# EAGLE design Cymbals (EAGLE 9.2.2)
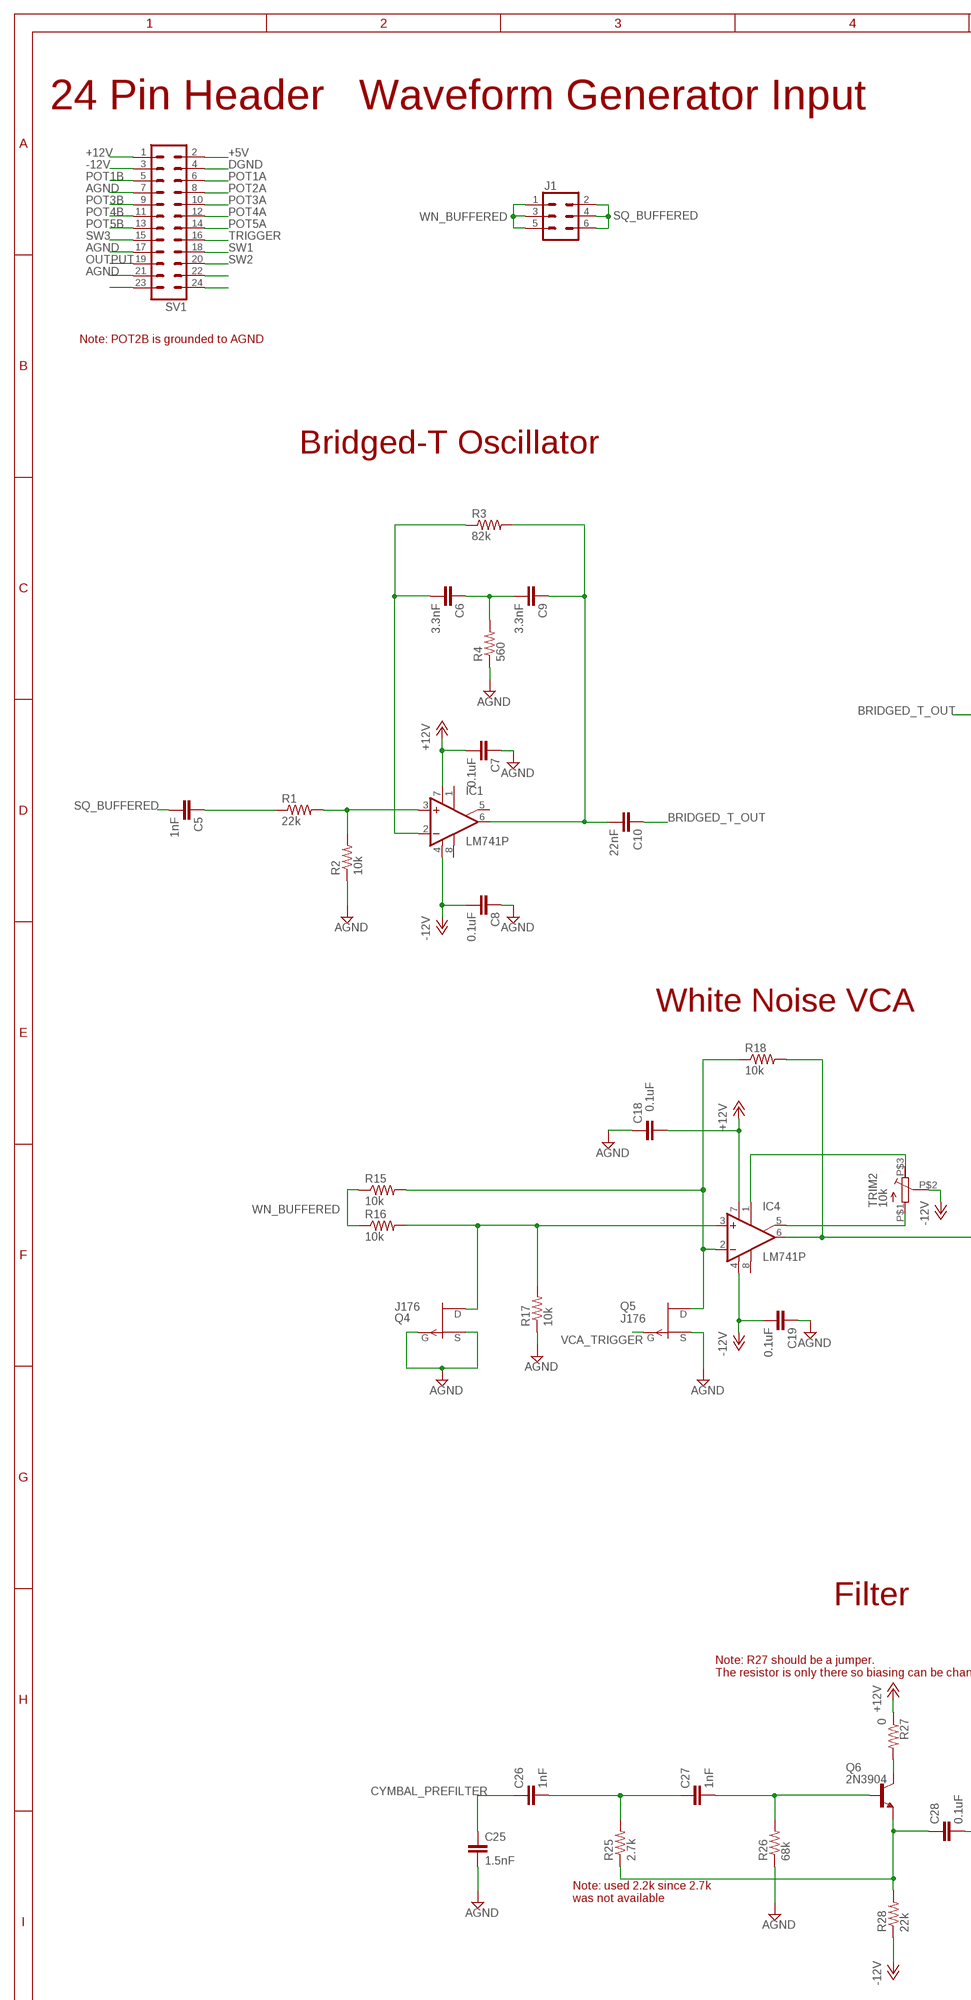
[diagram p0: schematic, sheet 1, part 1 of 2]
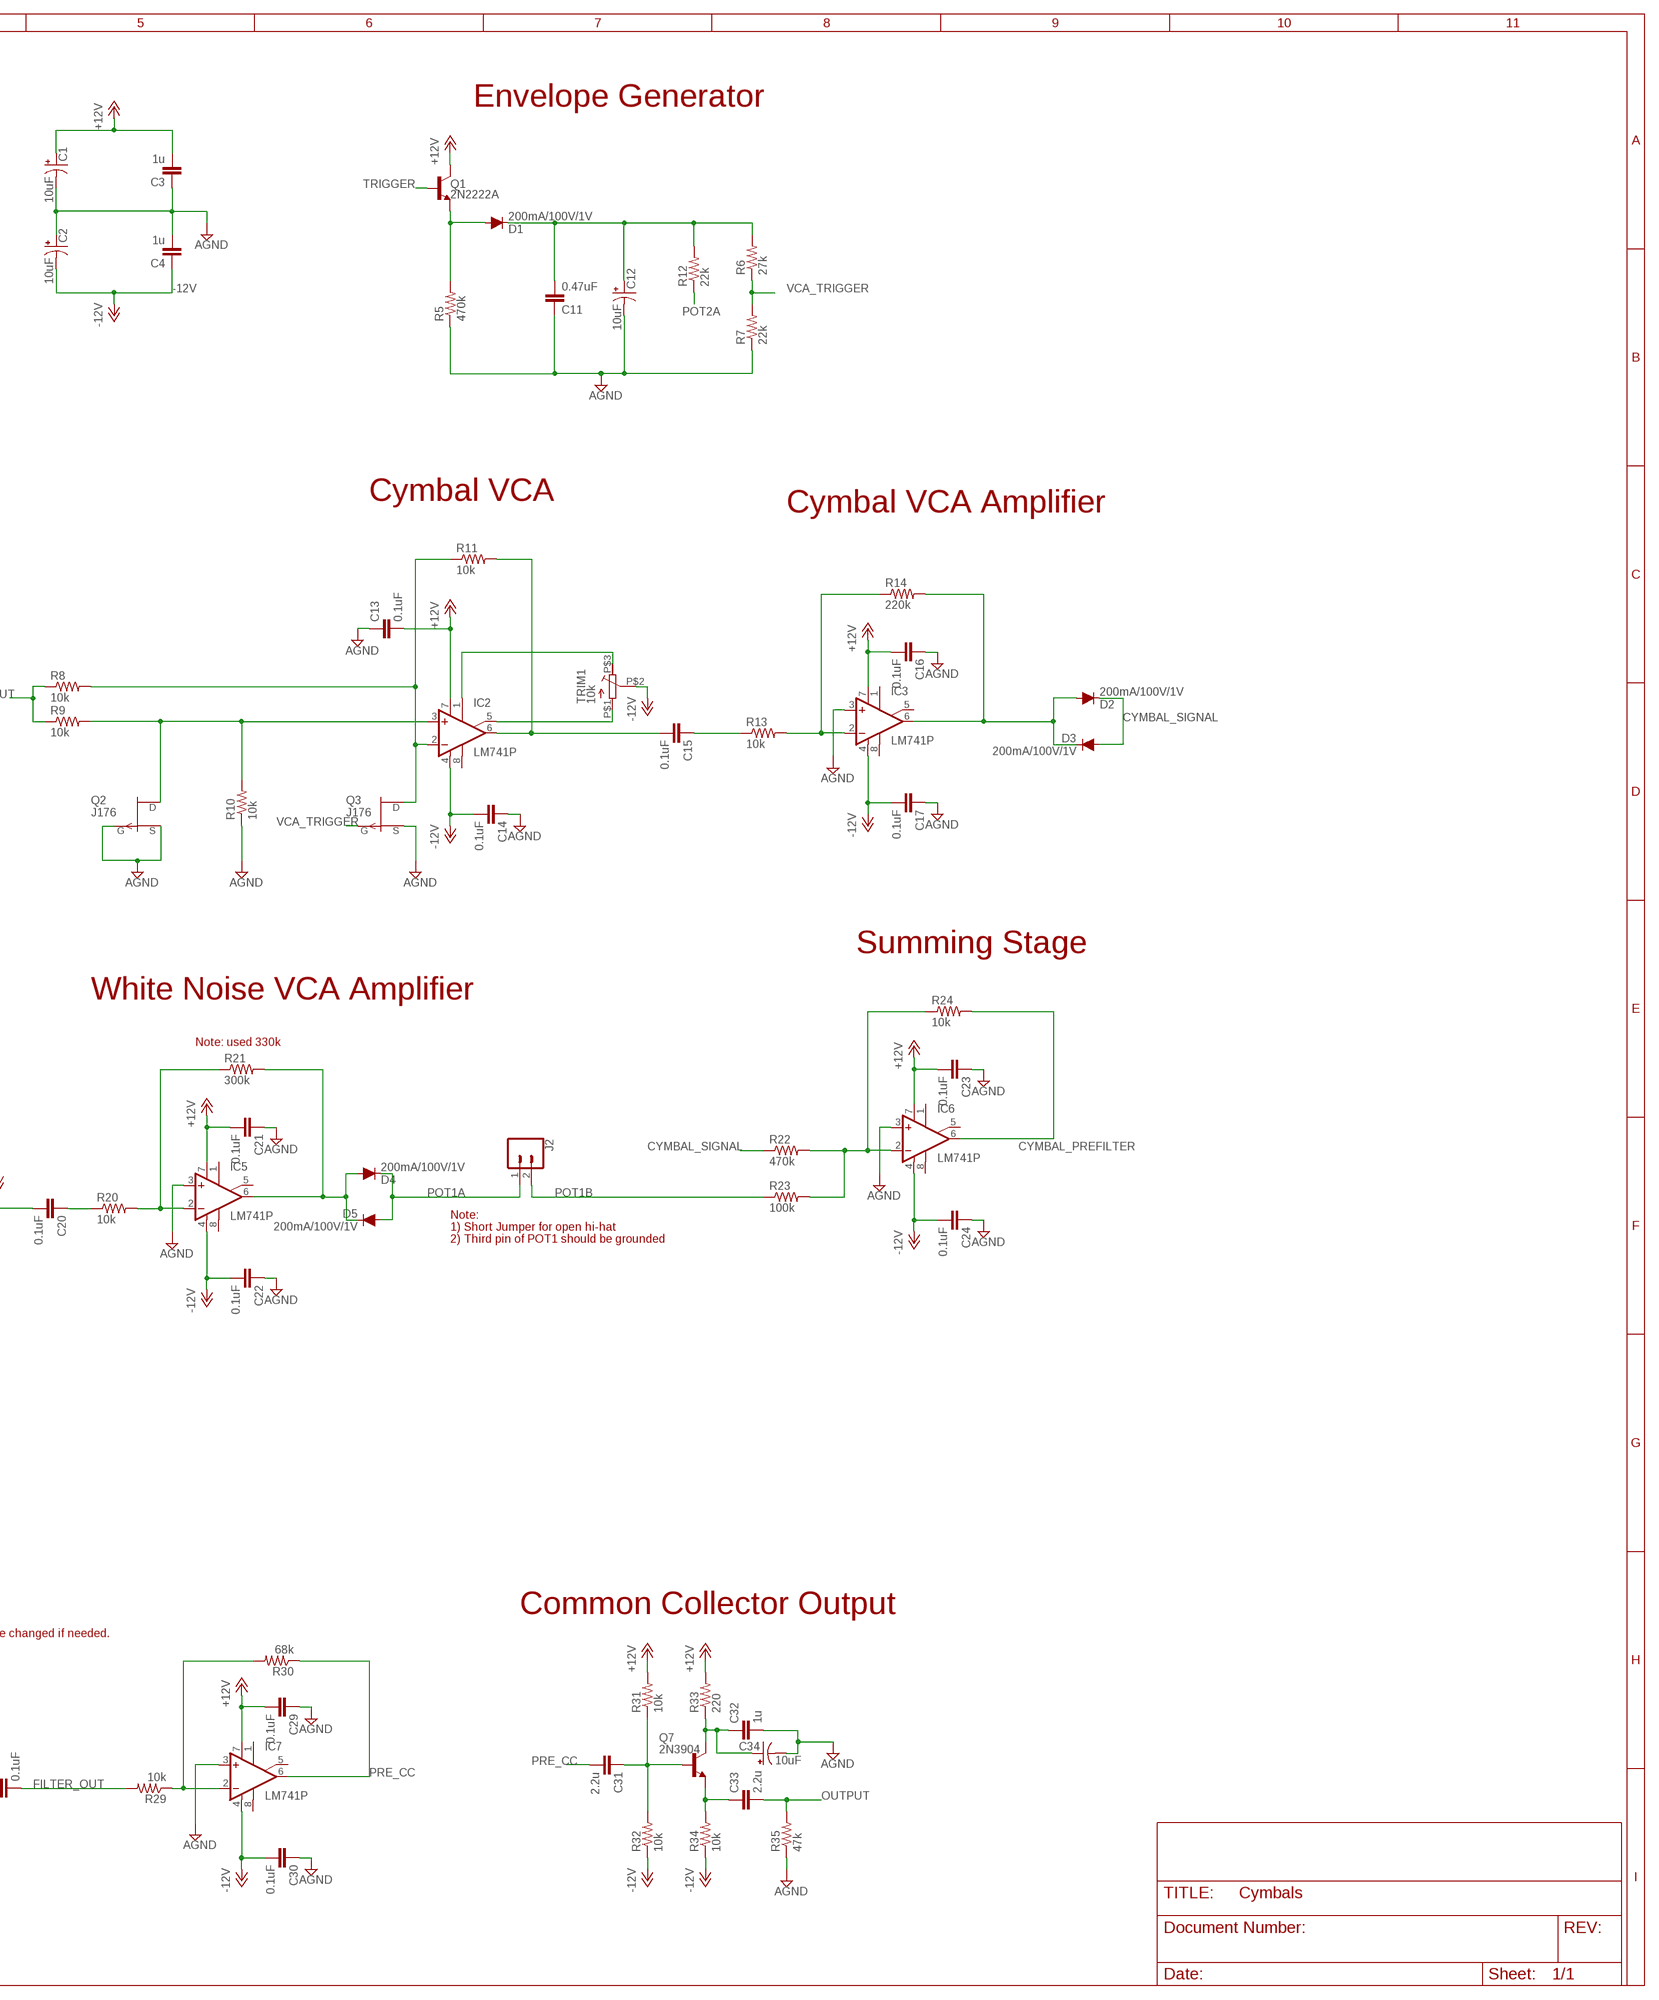
[diagram p1: schematic, sheet 1, part 2 of 2]

## Parts
C1  10uF  CPOL-USE2.5-6  [E2,5-6]
C2  10uF  CPOL-USE2.5-6  [E2,5-6]
C3  1u  C-EU050-024X044  [C050-024X044]
C4  1u  C-EU050-024X044  [C050-024X044]
C5  1nF  C-EU050-024X044  [C050-024X044]
C6  3.3nF  C-EU050-024X044  [C050-024X044]
C7  0.1uF  C-EU050-024X044  [C050-024X044]
C8  0.1uF  C-EU050-024X044  [C050-024X044]
C9  3.3nF  C-EU050-024X044  [C050-024X044]
C10  22nF  C-EU050-024X044  [C050-024X044]
C11  0.47uF  C-EU050-024X044  [C050-024X044]
C12  10uF  CPOL-USE2.5-6  [E2,5-6]
C13  0.1uF  C-EU050-024X044  [C050-024X044]
C14  0.1uF  C-EU050-024X044  [C050-024X044]
C15  0.1uF  C-EU050-024X044  [C050-024X044]
C16  0.1uF  C-EU050-024X044  [C050-024X044]
C17  0.1uF  C-EU050-024X044  [C050-024X044]
C18  0.1uF  C-EU050-024X044  [C050-024X044]
C19  0.1uF  C-EU050-024X044  [C050-024X044]
C20  0.1uF  C-EU050-024X044  [C050-024X044]
C21  0.1uF  C-EU050-024X044  [C050-024X044]
C22  0.1uF  C-EU050-024X044  [C050-024X044]
C23  0.1uF  C-EU050-024X044  [C050-024X044]
C24  0.1uF  C-EU050-024X044  [C050-024X044]
C25  1.5nF  C-EU050-024X044  [C050-024X044]
C26  1nF  C-EU050-024X044  [C050-024X044]
C27  1nF  C-EU050-024X044  [C050-024X044]
C28  0.1uF  C-EU050-024X044  [C050-024X044]
C29  0.1uF  C-EU050-024X044  [C050-024X044]
C30  0.1uF  C-EU050-024X044  [C050-024X044]
C31  2.2u  C-EU050-024X044  [C050-024X044]
C32  1u  C-EU050-024X044  [C050-024X044]
C33  2.2u  C-EU050-024X044  [C050-024X044]
C34  10uF  CPOL-USE2.5-6  [E2,5-6]
D1  200mA/100V/1V  DIODE-1N4148  [DIODE-1N4148]
D2  200mA/100V/1V  DIODE-1N4148  [DIODE-1N4148]
D3  200mA/100V/1V  DIODE-1N4148  [DIODE-1N4148]
D4  200mA/100V/1V  DIODE-1N4148  [DIODE-1N4148]
D5  200mA/100V/1V  DIODE-1N4148  [DIODE-1N4148]
IC1  LM741P  [DIL08]
IC2  LM741P  [DIL08]
IC3  LM741P  [DIL08]
IC4  LM741P  [DIL08]
IC5  LM741P  [DIL08]
IC6  LM741P  [DIL08]
IC7  LM741P  [DIL08]
J1  CONN_03X2NO_SILK  [2X3-NS]
J2  CONN_02  [1X02]
Q1  2N2222A  TRANS_NPN-P2N2222A  [TO-92]
Q2  J176  [TO-92]
Q3  J176  [TO-92]
Q4  J176  [TO-92]
Q5  J176  [TO-92]
Q6  2N3904  [TO92]
Q7  2N3904  [TO92]
R1  22k  R-US_0207/7  [0207/7]
R2  10k  R-US_0207/7  [0207/7]
R3  82k  R-US_0207/7  [0207/7]
R4  560  R-US_0207/7  [0207/7]
R5  470k  R-US_0207/7  [0207/7]
R6  27k  R-US_0207/7  [0207/7]
R7  22k  R-US_0207/7  [0207/7]
R8  10k  R-US_0207/7  [0207/7]
R9  10k  R-US_0207/7  [0207/7]
R10  10k  R-US_0207/7  [0207/7]
R11  10k  R-US_0207/7  [0207/7]
R12  22k  R-US_0207/7  [0207/7]
R13  10k  R-US_0207/7  [0207/7]
R14  220k  R-US_0207/7  [0207/7]
R15  10k  R-US_0207/7  [0207/7]
R16  10k  R-US_0207/7  [0207/7]
R17  10k  R-US_0207/7  [0207/7]
R18  10k  R-US_0207/7  [0207/7]
R20  10k  R-US_0207/7  [0207/7]
R21  300k  R-US_0207/7  [0207/7]
R22  470k  R-US_0207/7  [0207/7]
R23  100k  R-US_0207/7  [0207/7]
R24  10k  R-US_0207/7  [0207/7]
R25  2.7k  R-US_0207/7  [0207/7]
R26  68k  R-US_0207/7  [0207/7]
R27  0  R-US_0207/7  [0207/7]
R28  22k  R-US_0207/7  [0207/7]
R29  10k  R-US_0207/7  [0207/7]
R30  68k  R-US_0207/7  [0207/7]
R31  10k  R-US_0207/7  [0207/7]
R32  10k  R-US_0207/7  [0207/7]
R33  220  R-US_0207/7  [0207/7]
R34  10k  R-US_0207/7  [0207/7]
R35  47k  R-US_0207/7  [0207/7]
SV1  MA12-2  [MA12-2]
TRIM1  10k  10K_TRIMMER  [10K_TRIM]
TRIM2  10k  10K_TRIMMER  [10K_TRIM]

## Nets
+5V: SV1.2
+12V: C1.+ C3.2 C7.2 C13.2 C16.2 C18.2 C21.2 C23.2 C29.2 IC1.7(V+) IC2.7(V+) IC3.7(V+) IC4.7(V+) IC5.7(V+) IC6.7(V+) IC7.7(V+) Q1.1(C) R27.1 R31.2 R33.2 SV1.1
-12V: C2.- C4.1 C8.2 C14.2 C17.2 C19.2 C22.2 C24.2 C30.2 IC1.4(V-) IC2.4(V-) IC3.4(V-) IC4.4(V-) IC5.4(V-) IC6.4(V-) IC7.4(V-) R28.1 R32.1 R34.1 SV1.3 TRIM1.P$2(S) TRIM2.P$2(S)
AGND: C1.- C2.+ C3.1 C4.2 C7.1 C8.1 C11.1 C12.- C13.1 C14.1 C16.1 C17.1 C18.1 C19.1 C21.1 C22.1 C23.1 C24.1 C25.2 C29.1 C30.1 C32.2 C34.- IC3.3(+IN) IC5.3(+IN) IC6.3(+IN) IC7.3(+IN) Q2.2(G) Q2.3(S) Q3.3(S) Q4.2(G) Q4.3(S) Q5.3(S) R2.1 R4.1 R5.1 R7.1 R10.1 R17.1 R26.1 R35.1 SV1.7 SV1.17 SV1.21
BRIDGED_T_OUT: C10.1 R8.1 R9.1
CYMBAL_PREFILTER: C25.1 C26.1 IC6.6(OUT) R24.2
CYMBAL_SIGNAL: D2.C D3.A R22.1
DGND: SV1.4
FILTER_OUT: C28.2 R29.2
N$1: C15.2 IC2.6(OUT) R11.2
N$2: IC2.3(+IN) Q2.1(D) R9.2 R10.2
N$3: IC2.2(-IN) Q3.1(D) R8.2 R11.1
N$4: IC2.5(ON2) TRIM1.P$1(A)
N$5: Q6.1(C) R27.2
N$6: C11.2 C12.+ D1.C R6.2 R12.2
N$7: IC2.1(ON1) TRIM1.P$3(E)
N$8: IC3.2(-IN) R13.2 R14.1
N$10: IC6.2(-IN) R22.2 R23.2 R24.1
N$14: C6.2 IC1.2(-IN) R3.1
N$24: SV1.23
N$25: SV1.24
N$26: SV1.22
N$27: C15.1 R13.1
N$32: IC5.2(-IN) R20.2 R21.1
N$33: IC7.2(-IN) R29.1 R30.2
N$34: C20.1 R20.1
N$36: C20.2 IC4.6(OUT) R18.2
N$38: D4.A D5.C IC5.6(OUT) R21.2
N$39: D2.A D3.C IC3.6(OUT) R14.2
N$47: C6.1 C9.2 R4.2
N$60: C9.1 C10.2 IC1.6(OUT) R3.2
N$61: IC1.3(+IN) R1.2 R2.2
N$62: C5.1 R1.1
N$63: C31.1 Q7.2(B) R31.1 R32.2
N$64: D1.A Q1.3(E) R5.2
N$65: IC4.3(+IN) Q4.1(D) R16.2 R17.2
N$66: IC4.2(-IN) Q5.1(D) R15.2 R18.1
N$67: IC4.5(ON2) TRIM2.P$1(A)
N$68: IC4.1(ON1) TRIM2.P$3(E)
N$71: C33.1 Q7.3(E) R34.2
N$72: C32.1 C34.+ Q7.1(C) R33.1
N$73: C26.2 C27.1 R25.2
N$74: C27.2 Q6.2(B) R26.2
N$75: C28.1 Q6.3(E) R25.1 R28.2
OUTPUT: C33.2 R35.2 SV1.19
POT1A: D4.C D5.A J2.1 SV1.6
POT1B: J2.2 R23.1 SV1.5
POT2A: R12.1 SV1.8
POT3A: SV1.10
POT3B: SV1.9
POT4A: SV1.12
POT4B: SV1.11
POT5A: SV1.14
POT5B: SV1.13
PRE_CC: C31.2 IC7.6(OUT) R30.1
SQ_BUFFERED: C5.2 J1.2 J1.4 J1.6
SW1: SV1.18
SW2: SV1.20
SW3: SV1.15
TRIGGER: Q1.2(B) SV1.16
VCA_TRIGGER: Q3.2(G) Q5.2(G) R6.1 R7.2
WN_BUFFERED: J1.1 J1.3 J1.5 R15.1 R16.1
Unconnected: IC1.1(ON1) IC1.5(ON2) IC1.8(OPT) IC2.8(OPT) IC3.1(ON1) IC3.5(ON2) IC3.8(OPT) IC4.8(OPT) IC5.1(ON1) IC5.5(ON2) IC5.8(OPT) IC6.1(ON1) IC6.5(ON2) IC6.8(OPT) IC7.1(ON1) IC7.5(ON2) IC7.8(OPT)

## Notes on the sheet
- 24 Pin Header | Waveform Generator Input | Envelope Generator
- Note: POT2B is grounded to AGND
- Bridged-T Oscillator
- Cymbal VCA
- Cymbal VCA Amplifier
- Summing Stage
- White Noise VCA
- White Noise VCA Amplifier
- Note: used 330k
- Note: 
  1) Short Jumper for open hi-hat
  2) Third pin of POT1 should be grounded
- Filter
- Common Collector Output
- Note: R27 should be a jumper.
  The resistor is only there so biasing can be changed if needed.
- Note: used 2.2k since 2.7k 
  was not available

## Library data of the parts
C1 C2 C12 C34 = rcl:CPOL-US: POLARIZED CAPACITOR, American symbol; SPICEPREFIX: C
C3-C11 C13-C33 = resistor:C-EU: CAPACITOR, European symbol
D1-D5 = SparkFun-DiscreteSemi:DIODE: Diode These are standard reverse protection diodes and small signal diodes. SparkFun Products: SparkFun SparkPunk Sound Kit <https://www.sparkfun.com/products/11177> SparkFun ESP8266 Thing <https://www.sparkfun.com/products/13231>; PROD_ID: DIO-08378
IC1-IC7 = linear:*741: OP AMP
J1 = SparkFun-Connectors:CONN_03X2: Multi connection point. Often used as Generic Header-pin footprint for 0.1 inch spaced/style header connections You can populate with any combo of single row headers, but if you'd like an exact match, check these: Header - 2x3 (Male, 0.1") <https://www.sparkfun.com/products/12807> (PRT-12807) Header - 2x3 (Female, 0.1") <https://www.sparkfun.com/products/13010> (PRT-13010) 2x3 Pin Shrouded Header <https://www.sparkfun.com/products/10877> (PRT-10877) On any of the 0.1 inch spaced packages, you can populate with these: Break Away Headers - Straight <https://www.sparkfun.com/products/116> (PRT-00116) Break Away Male Headers - Right Angle <https://www.sparkfun.com/products/553> (PRT-00553) Female Headers <https://www.sparkfun.com/products/115> (PRT-00115) Break Away Headers - Machine Pin <https://www.sparkfun.com/products/117> (PRT-00117) Break Away Female Headers - Swiss Machine Pin <https://www.sparkfun.com/products/743> (PRT-00743) Special note: the shrouded connector mates well with our 3x2 ribbon cables: Ribbon Crimp Connector - 6-pin (2x3, Female) <https://www.sparkfun.com/products/10651> (PRT-10651) Ribbon Cable - 6 wire (15ft) <https://www.sparkfun.com/products/10646> (PRT-10646)
J2 = SparkFun-Connectors:CONN_02: Multi connection point. Often used as Generic Header-pin footprint for 0.1 inch spaced/style header connections On any of the 0.1 inch spaced packages, you can populate with these: Break Away Headers - Straight <https://www.sparkfun.com/products/116> (PRT-00116) Break Away Male Headers - Right Angle <https://www.sparkfun.com/products/553> (PRT-00553) Female Headers <https://www.sparkfun.com/products/115> (PRT-00115) Break Away Headers - Machine Pin <https://www.sparkfun.com/products/117> (PRT-00117) Break Away Female Headers - Swiss Machine Pin <https://www.sparkfun.com/products/743> (PRT-00743) For SCREWTERMINALS and SPRING TERMINALS visit here: Screw Terimnals on SparkFun.com <https://www.sparkfun.com/search/results?term=Screw+Terminals> (5mm/3.5mm/2.54mm spacing) This device is also useful as a general connection point to wire up your design to another part of your project. Our various solder wires solder well into these plated through hole pads. Hook-Up Wire - Assortment (Stranded, 22 AWG) <https://www.sparkfun.com/products/11375> (PRT-11375) Hook-Up Wire - Assortment (Solid Core, 22 AWG) <https://www.sparkfun.com/products/11367> (PRT-11367) View the entire wire category on our website here <https://www.sparkfun.com/categories/141> Special notes: Molex polarized connector foot print use with: PRT-08233 with associated crimp pins and housings. 2.54_SCREWTERM for use with PRT-10571. 3.5mm Screw Terminal footprints for PRT-08084 5mm Screw Terminal footprints for use with PRT-08432
Q1 = SparkFun-DiscreteSemi:TRANS_NPN: NPN transistor Current controlled devices typically used to amplify current or used as a switch. BC547 - COM-08928 <http://www.sparkfun.com/products/8928> (TO-92 45V 100mA) (1.Collector 2.Base 3.Emitter) 2N3904 - COM-00521 <http://www.sparkfun.com/products/521> (TO-92 40V 200mA) (1.Emitter 2.Base 3.Collector) P2N2222A - COM-12852 <http://www.sparkfun.com/products/12852> (TO-92 40V 600mA) (1.Collector 2.Base 3.Emitter); PROD_ID: TRANS-09536; VALUE: 600mA/40V
Q2-Q5 = Capstone:J176
Q6 Q7 = transistor:2N3904: NPN TRANSISTOR
R1-R18 R20-R35 = rcl:R-US_: RESISTOR, American symbol; SPICEPREFIX: R
SV1 = con-lstb:MA12-2: PIN HEADER; OC_FARNELL: unknown; OC_NEWARK: unknown
TRIM1 TRIM2 = Capstone:10K_TRIMMER

## Board
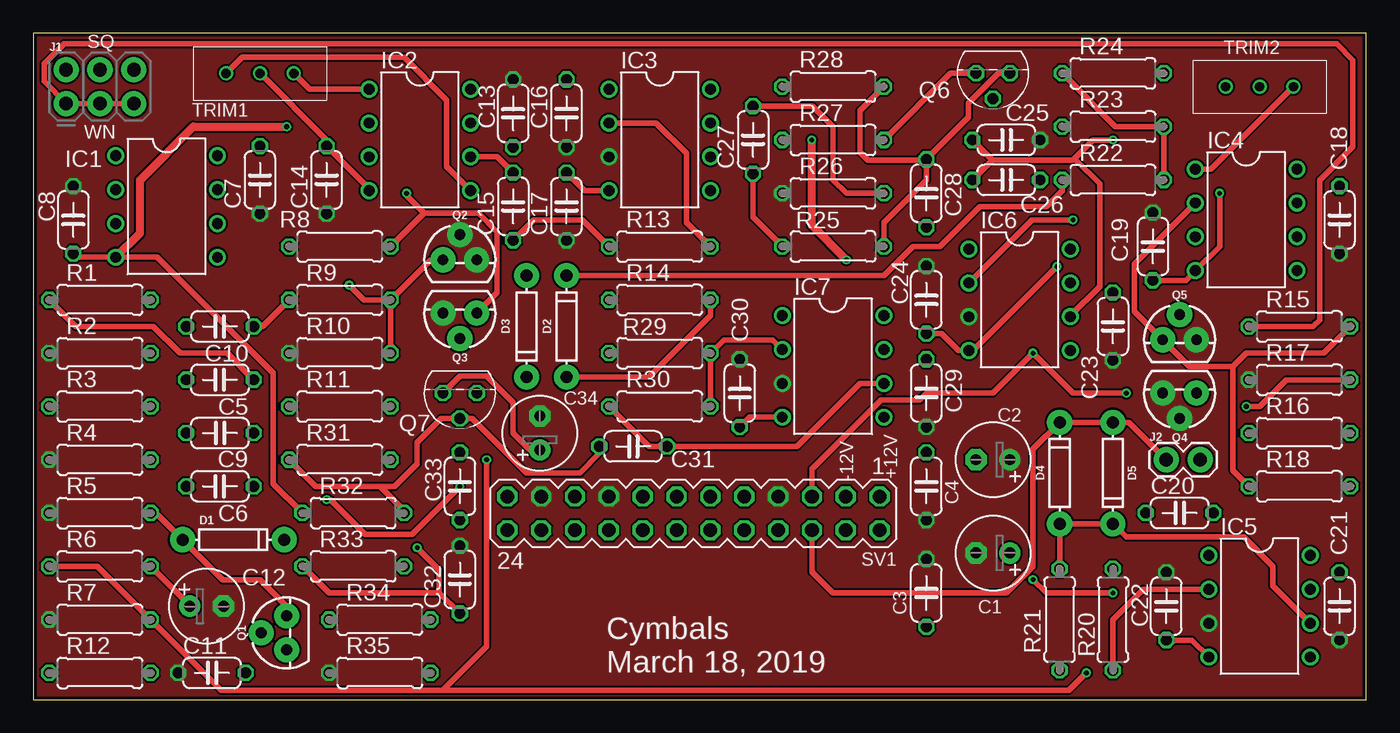
[diagram p2: board, top side]
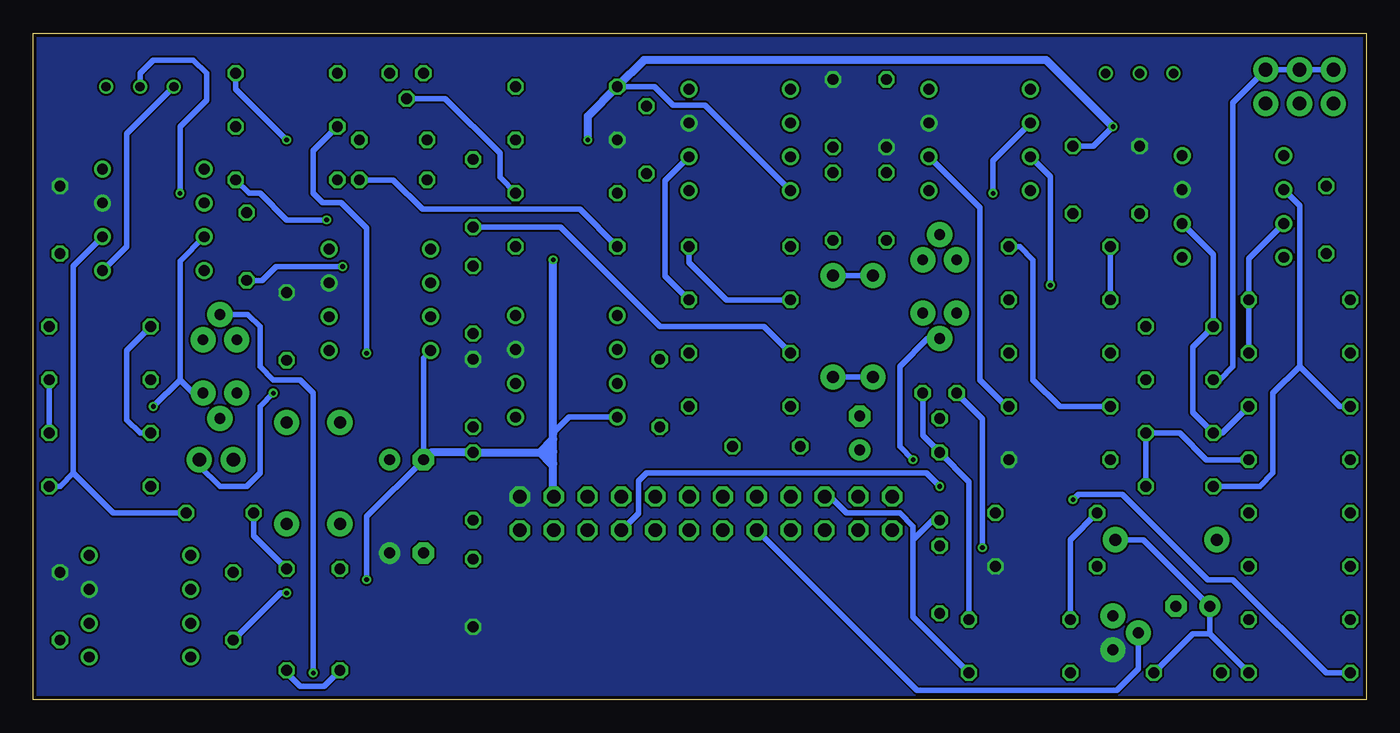
[diagram p3: board, bottom side, seen from below]

Size 100 x 50 mm. Coordinates in mm from the lower left corner, seen from the top.
Outline: 0,0 100,0 100,50 0,50 0,0
Copper layers (1*16): Top 0.035mm / dielectric 1.5mm / Bottom 0.035mm
Design rules "JLCPCB2Layer": minimum track width 6mil, minimum drill 10mil, track to track 6mil, track to pad 6mil, pad to pad 6mil, via to via 6mil, smd to smd 0mil, copper to edge 10mil, drill to drill 10mil, minimum pad ring 6mil, minimum via ring 6mil, stop-mask expansion 2mil, vias tented up to drill 100mil, thermal gap 10mil

### Footprints (pad centres in the part's own frame; a part is rotated, then mirrored left to right if it is on the bottom)
E2,5-6 = drill 0.813 pad 1.6: + -1.27,0 | drill 0.813 pad 1.6 octagon: - 1.27,0
C050-024X044 = drill 0.813 octagon: 1 -2.54,0; 2 2.54,0
DIODE-1N4148 = drill 0.9 pad 1.88: A -3.81,0; C 3.81,0
DIL08 = drill 0.813 pad 1.27: 1 -3.81,-3.81; 2 -1.27,-3.81; 3 1.27,-3.81; 4 3.81,-3.81; 5 3.81,3.81; 6 1.27,3.81; 7 -1.27,3.81; 8 -3.81,3.81
2X3-NS = drill 1.016 pad 1.88: 1 -2.54,-1.27; 2 -2.54,1.27; 3 0,-1.27; 4 0,1.27; 5 2.54,-1.27; 6 2.54,1.27
1X02 = drill 1.016 pad 1.88: 1 0,0; 2 2.54,0
TO-92 = drill 0.813 pad 1.88: 1 -1.27,0; 2 0,1.905; 3 1.27,0
TO92 = drill 0.813 octagon: 1 1.27,0; 2 0,1.905; 3 -1.27,0
0207/7 = drill 0.813 octagon: 1 -3.81,0; 2 3.81,0
MA12-2 = drill 1.016 octagon: 1 -13.97,-1.27; 2 -13.97,1.27; 3 -11.43,-1.27; 4 -11.43,1.27; 5 -8.89,-1.27; 6 -8.89,1.27; 7 -6.35,-1.27; 8 -6.35,1.27; 9 -3.81,-1.27; 10 -3.81,1.27; 11 -1.27,-1.27; 12 -1.27,1.27; 13 1.27,-1.27; 14 1.27,1.27; 15 3.81,-1.27; 16 3.81,1.27; 17 6.35,-1.27; 18 6.35,1.27; 19 8.89,-1.27; 20 8.89,1.27; 21 11.43,-1.27; 22 11.43,1.27; 23 13.97,-1.27; 24 13.97,1.27
10K_TRIM = drill 0.7: P$1 2.46,2; P$2 5,2; P$3 7.54,2

### Placement (x,y rotation side)
C1  72,11 180 top
C2  72,18 180 top
C3  67,8 270 top
C4  67,16 270 top
C5  14,24 180 top
C6  14,16 180 top
C7  17,39 90 top
C8  3,36 270 top
C9  14,20 0 top
C10  14,28 180 top
C11  13.4,2 0 top
C12  13,7 0 top
C13  36,44 270 top
C14  22,39 90 top
C15  36,37 90 top
C16  40,44 90 top
C17  40,37 90 top
C18  98,36 90 top
C19  84,34 270 top
C20  86,14 0 top
C21  98,7 90 top
C22  85,7 270 top
C23  81,28 90 top
C24  67,30 270 top
C25  73,42 0 top
C26  73,39 0 top
C27  54,42 90 top
C28  67,38 270 top
C29  67,23 90 top
C30  53,23 270 top
C31  45,19 0 top
C32  32,9 90 top
C33  32,16 270 top
C34  38,20 90 top
D1  15,12 0 top
D2  40,28 90 top
D3  37,28 270 top
D4  77,17 90 top
D5  81,17 270 top
IC1  10,37 270 top
IC2  29,42 270 top
IC3  47,42 270 top
IC4  91,36 270 top
IC5  92,7 270 top
IC6  74,30 270 top
IC7  60,25 270 top
J1  5,46 0 top
J2  85,18 0 top
Q1  19,5 90 top
Q2  32,33 0 top
Q3  32,29 180 top
Q4  86,23 180 top
Q5  86,27 0 top
Q6  72,47 180 top
Q7  32,23 180 top
R1  5,30 0 top
R2  5,26 0 top
R3  5,22 0 top
R4  5,18 0 top
R5  5,14 0 top
R6  5,10 0 top
R7  5,6 0 top
R8  23,34 0 top
R9  23,30 0 top
R10  23,26 0 top
R11  23,22 0 top
R12  5,2 0 top
R13  47,34 0 top
R14  47,30 0 top
R15  95,28 0 top
R16  95,20 0 top
R17  95,24 0 top
R18  95,16 0 top
R20  81,6 270 top
R21  77,6 90 top
R22  81,39 0 top
R23  81,43 0 top
R24  81,47 0 top
R25  60,34 180 top
R26  60,38 0 top
R27  60,42 0 top
R28  60,46 0 top
R29  47,26 180 top
R30  47,22 0 top
R31  23,18 0 top
R32  24,14 0 top
R33  24,10 0 top
R34  26,6 0 top
R35  26,2 0 top
SV1  49.53,13.97 180 top
TRIM1  12,45 0 top
TRIM2  87,44 0 top

### Tracks (layer width: path | path; a pad name or v marks a point on that pad's centre or on a via)
+12V
  pour Bottom (no thermals): -2,52 102,52 102,-2 -2,-2
-12V  (via drill 0.35)
  Top 0.406: C22.2 86.92,4.46 IC5.4 | C19.2 86.46,31.46 IC4.4 89,34 v89,38 | TRIM1.P$2 22,42 C14.2 25.19,38.35 IC2.4 | C17.2 41.35,38.19 IC3.4 | C24.2 68.14,27.46 69.41,26.19 IC6.4 70.49,26.19 v76.8,32.5 | C30.2 53.73,21.19 IC7.4 | R32.1 18,16.19 18,24.5 9.31,33.19 IC1.4 3.27,33.19 C8.2 | v75,9 76,8 v81,8
  Top 0.61: v61,33 58.4,35.6 v58.4,42 | IC1.4 8,35 8,39 12,43 v19,43
  Bottom 0.406: v89,38 89,43 87,45 87,47 88,48 91,48 92,47 TRIM2.P$2 | R34.1 22.19,12 R32.1 | v19,43 20.46,41.54 C14.2 | IC3.4 49.6,44.6 52,44.6 53.4,46 R28.1 | IC7.4 59.81,21.19 61,20 | IC6.4 70.73,25.65 C2.- 75,13.73 v75,9 | v76.8,32.5 81.8,32.5 82.84,31.46 C19.2 | v81,8 81.46,8 C22.2
  Bottom 0.61: SV1.3 61,15.28 61,17.7 | 61,17.7 61,18.6 | 61,18.6 61,19.54 | 61,19.54 61,20 v61,33 | v58.4,42 58.4,43.79 R28.1 54.19,48 24,48 v19,43 | C2.- 70.19,18.54 C4.1 62,18.54 | 61,18.6 61.06,18.54 62,18.54 | 62,18.54 61,19.54 | 62,18.54 61.16,17.7 61,17.7
AGND
  pour Top (no thermals): -1,51 -1,-1 101,-1 101,51
BRIDGED_T_OUT
  Top 0.406: R9.1 17.19,28 C10.1
  Bottom 0.406: R8.1 R9.1
CYMBAL_PREFILTER  (via drill 0.35)
  Top 0.406: C26.1 71.96,40.5 | 71.96,40.5 78,40.5 | 78,40.5 78.2,40.5 80,38.7 80,31 77.81,28.81 IC6.6 | 78,40.5 79.5,42 v81,42 | C25.1 71.96,40.5
  Bottom 0.406: v81,42 84.81,45.81 R24.2
CYMBAL_SIGNAL
  Top 0.406: D2.C 63.81,31.81 66,34 68,34 71,37 76,37 77.19,38.19 R22.1
  Bottom 0.406: D3.A D2.C
FILTER_OUT
  Bottom 0.406: R29.2 45.19,28 53,28 60.46,35.46 C28.2
N$1
  Top 0.406: IC2.6 34.81,40.73 C15.2
  Bottom 0.406: IC2.6 29,36.92 29,24 27,22 R11.2
N$2  (via drill 0.35)
  Top 0.406: R9.2 29.81,33 Q2.1 | v23.7,31.1 24.8,30 R9.2 | R9.2 R10.2
  Bottom 0.406: IC2.3 23.7,39.24 v23.7,31.1
N$3  (via drill 0.35)
  Top 0.406: R8.2 29.31,36.5 | Q3.1 34.8,30.53 34.8,35.1 33.4,36.5 29.31,36.5 | 29.31,36.5 28,37.81 v28,38
  Bottom 0.406: R8.2 26,34 25,33 25,24 23,22 R11.1 | v28,38 28,40.46 IC2.2
N$4
  Top 0.406: TRIM1.P$1 15.66,48.2 27.8,48.2 31,45 31,40 IC2.5
N$5
  Top 0.406: R27.2 68.81,47 Q6.1
N$6
  Top 0.406: R6.2 11.73,7.08 C12.+
  Bottom 0.406: R12.2 11.73,4.92 | 11.73,4.92 C12.+ 16.73,12 D1.C | 11.73,4.92 13.02,4.92 C11.2
N$7
  Top 0.406: TRIM1.P$3 20.73,45.81 IC2.1
N$8
  Top 0.406: IC3.2 46.73,43.27 49,41 49,35.81 R13.2
  Bottom 0.406: R13.2 50.81,32.81 48,30 R14.1
N$10  (via drill 0.35)
  Top 0.406: R24.1 81.19,43 R23.2 R22.2 | IC6.2 74.92,36 v78,36
  Bottom 0.406: v78,36 81,36 83,38 83.81,38 R22.2
N$14
  Bottom 0.406: IC1.2 5,37.08 5,25 | 5,25 2,22 R3.1 | 5,25 7,23 7,17 8,16 C6.2
N$27
  Top 0.406: C15.1 37.54,36 41.19,36 R13.1
N$32
  Top 0.406: R20.2 81,6 83.27,8.27 IC5.2
  Bottom 0.406: R21.1 78.19,1 80,1 81,2 R20.2
N$33
  Top 0.406: R30.2 R29.1 51.81,27 55.46,27 IC7.2
N$34
  Bottom 0.406: C20.1 83.46,12.27 R20.1
N$36
  Bottom 0.406: IC4.6 97,32.54 97,17 | 97,17 98,16 R18.2 | 97,17 94,14 C20.2
N$38
  Top 0.406: IC5.6 93,8.54 93,10 90.8,12.2 81.99,12.2 D5.C D4.A R21.2
N$39
  Top 0.406: D2.A 46.19,24.19 50.81,28.81 R14.2
  Bottom 0.406: D2.A D3.C | IC3.6 52.6,38.94 52.6,31.79 R14.2
N$47
  Bottom 0.406: C6.1 C9.2 14,20 12,18 R4.2
N$60
  Bottom 0.406: IC1.6 11.46,33.38 C10.2 13,26.46 13,21.54 C9.1 10.81,20 R3.2
N$61
  Bottom 0.406: R2.2 R1.2 8.81,33.11 IC1.3
N$62
  Top 0.406: R1.1 3.19,28 9,28 11,26 14.54,26 C5.1
N$63
  Top 0.406: R31.1 21.19,16 26,16 | 26,16 27.81,14.19 R32.2 | 26,16 27.1,16 28.8,17.7 28.8,19.3 30.6,21.1 30.61,21.09 Q7.2 32.91,21.09 37,17 41,17 42.46,18.46 C31.1
N$64
  Top 0.406: Q1.3 19,7 17,9 14.19,9 D1.A 9.19,14 R5.2
N$65  (via drill 0.35)
  Top 0.406: R17.2 94,24 92,22 v91,22
  Bottom 0.406: IC4.3 89,32.92 89,24 | 89,24 88,23 Q4.1 | R17.2 R16.2 | v91,22 89,24
N$66
  Top 0.406: IC4.2 82.6,32.68 82.6,29.13 Q5.1 86.73,25 90,25 | 90,25 91,26 96.81,26 R15.2 | 90,25 90,17.19 R18.1
N$67
  Bottom 0.406: TRIM2.P$1 93,42.46 93,34 IC4.5
N$68
  Top 0.406: TRIM2.P$3 88.35,39.81 IC4.1
N$71
  Bottom 0.406: R34.2 29.81,16.35 C33.1 33.27,19.81 Q7.3
N$72  (via drill 0.35)
  Top 0.406: R33.1 22.19,8 30.46,8 | 30.46,8 C32.1 | Q7.1 32.03,24.3 34,24.3 36,22.3 36,20 37.27,18.73 C34.+ | v28.8,11.4 30.46,9.74 30.46,8
  Bottom 0.406: Q7.1 28.8,21.07 v28.8,11.4
N$73
  Top 0.406: C27.1 54,36.19 R25.2
  Bottom 0.406: R25.2 58.99,36.8 70.8,36.8 73,39 C26.2
N$74
  Top 0.406: C27.2 58.46,44.54 60,43 60,39 61,38 R26.2
  Bottom 0.406: R26.2 65,39.19 65,41 69.09,45.09 Q6.2
N$75
  Top 0.406: R28.2 62,44.19 62,41.1 62.6,40.5 66.96,40.5 | 66.96,40.5 C28.1 70.16,43.7 70.16,44.76 72.4,47 Q6.3 | R25.1 63.81,35.81 67,39 67,40.46 66.96,40.5
OUTPUT
  Bottom 0.406: R35.2 34,6.19 34,12 | 34,12 32.54,13.46 C33.2 | 34,12 34,13 35,14 39,14 40.24,15.24 SV1.19
POT1A
  Top 0.406: J2.1 82.19,20.81 D5.A D4.C 75,18.81 75,10 73,8 60,8 58.42,9.58 SV1.6
POT1B  (via drill 0.35)
  Top 0.406: v82,23 78,23 v75,26 72,23 67,23 66.5,22.5 63.6,22.5 58.42,17.32 SV1.5
  Bottom 0.406: R23.1 79,41.19 79,38 78.3,37.3 76.9,37.3 75,35.4 v75,26 | v82,23 83,22 83,17 84,16 86,16 87.54,17.54 J2.2
POT2A  (via drill 0.35)
  Top 0.406: v32,16 28.4,12.4 24.9,12.4 22.3,15 v22,15
  Bottom 0.406: v32,16 33,17 54,17 54.6,16.4 54.6,13.98 SV1.8 | v22,15 21.6,15.4 18.3,15.4 11.9,9 10,9 3,2 R12.1
PRE_CC
  Top 0.406: IC7.6 62.03,23.73 57.3,19 C31.2 46.19,19 R30.1
SQ_BUFFERED
  Bottom 0.406: C5.2 11,24 10,25 10,44.81 J1.6 J1.4 J1.2
TRIGGER
  Bottom 0.406: SV1.16 33.72,0.7 18.7,0.7 17.09,2.31 Q1.2
VCA_TRIGGER  (via drill 0.35)
  Top 0.406: 30.7,0.7 34,4 v34,18 | v79,2 77.7,0.7 30.7,0.7 | R6.1 4.81,10 R7.2 14.11,0.7 30.7,0.7
  Bottom 0.406: v34,18 35,19 35,25 32.91,27.09 Q3.2 | Q5.2 83.91,28.91 83,28 83,25 82,24 80,24 79,23 v79,2
WN_BUFFERED
  Top 0.406: J1.5 J1.3 J1.1 0.8,46.39 0.8,47.7 2.3,49.2 97.8,49.2 99,48 99,41.5 96.5,39 96.5,28.5 96,28 R15.1
  Bottom 0.406: R15.1 93,26.19 93,21 92,20 R16.1

### Text on the board
tPlace: SQ | WN | Cymbals / March 18, 2019
tNames: +12V | -12V